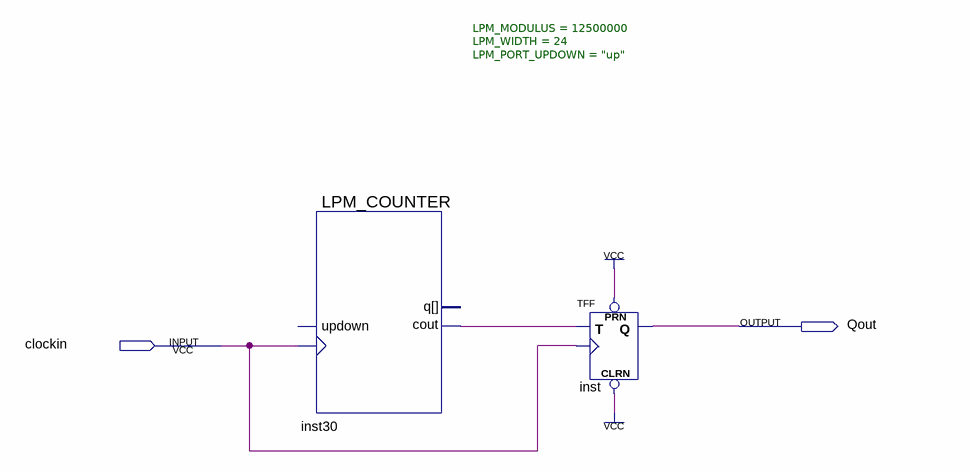
[diagram p0: schematic sheet]
// Quartus schematic Divisor_de_frequencia.bdf as structural Verilog: 2 symbols, 2 pins
module Divisor_de_frequencia (
  input  clockin,
  output Qout
);

  wire inst30_cout;

  LPM_COUNTER #(.LPM_MODULUS(12500000), .LPM_WIDTH(24), .LPM_PORT_UPDOWN("up")) inst30 (
    .clock(clockin), .cout(inst30_cout));  // open: updown, q
  TFF inst (.PRN(1'b1), .CLRN(1'b1), .T(inst30_cout), .CLK(clockin), .Q(Qout));
endmodule
